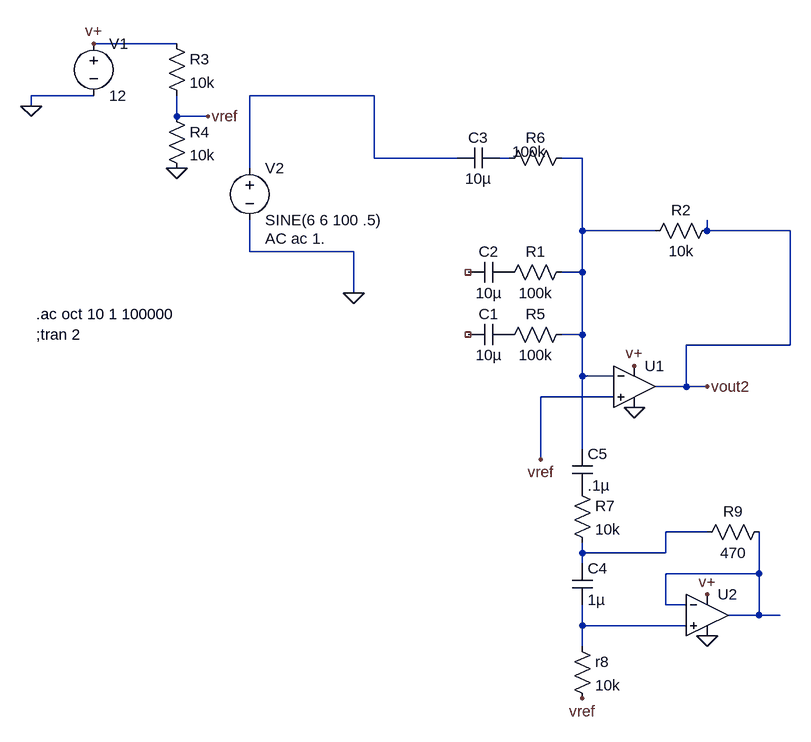
[diagram p0: schematic mixer.asc]
mixer.asc, the LTspice schematic file:
Version 4
SHEET 1 3432 680
WIRE 2416 -640 2288 -640
WIRE 2288 -560 2192 -560
WIRE 2720 -560 2528 -560
WIRE 2192 -544 2192 -560
WIRE 2416 -528 2416 -560
WIRE 2464 -528 2416 -528
WIRE 2720 -464 2720 -560
WIRE 2848 -464 2720 -464
WIRE 2928 -464 2912 -464
WIRE 3040 -464 3008 -464
WIRE 2528 -448 2528 -560
WIRE 3040 -352 3040 -464
WIRE 3152 -352 3040 -352
WIRE 3232 -352 3232 -368
WIRE 3360 -352 3232 -352
WIRE 2528 -320 2528 -368
WIRE 2688 -320 2528 -320
WIRE 3040 -288 3040 -352
WIRE 3040 -288 3008 -288
WIRE 2688 -256 2688 -320
WIRE 3040 -192 3040 -288
WIRE 3040 -192 3008 -192
WIRE 3360 -176 3360 -352
WIRE 3360 -176 3200 -176
WIRE 3040 -128 3040 -192
WIRE 3088 -128 3040 -128
WIRE 3200 -112 3200 -176
WIRE 3200 -112 3152 -112
WIRE 3232 -112 3200 -112
WIRE 3088 -96 2976 -96
WIRE 3040 -16 3040 -128
WIRE 2976 0 2976 -96
WIRE 3232 112 3168 112
WIRE 3040 144 3040 128
WIRE 3168 144 3168 112
WIRE 3168 144 3040 144
WIRE 3040 160 3040 144
WIRE 3312 176 3312 112
WIRE 3312 176 3168 176
WIRE 3168 224 3168 176
WIRE 3200 224 3168 224
WIRE 3312 240 3312 176
WIRE 3312 240 3264 240
WIRE 3344 240 3312 240
WIRE 3040 256 3040 224
WIRE 3200 256 3040 256
WIRE 3040 288 3040 256
FLAG 2688 -256 0
FLAG 2192 -544 0
FLAG 2288 -640 v+
FLAG 3120 -144 v+
FLAG 3232 -112 vout2
FLAG 2464 -528 vref
FLAG 2416 -448 0
FLAG 2976 0 vref
FLAG 3120 -80 0
FLAG 3232 208 v+
FLAG 3232 272 0
FLAG 3040 368 vref
SYMBOL voltage 2288 -656 R0
WINDOW 123 0 0 Left 2
WINDOW 39 0 0 Left 2
SYMATTR InstName V1
SYMATTR Value 12
SYMBOL voltage 2528 -464 R0
WINDOW 123 24 124 Left 2
WINDOW 39 0 0 Left 2
SYMATTR Value2 AC ac 1.
SYMATTR InstName V2
SYMATTR Value SINE(6 6 100 .5)
SYMBOL Opamps\\UniversalOpamp2 3120 -112 R0
SYMATTR InstName U1
SYMBOL res 3248 -368 R90
WINDOW 0 0 56 VBottom 2
WINDOW 3 32 56 VTop 2
SYMATTR InstName R2
SYMATTR Value 10k
SYMBOL cap 2912 -480 R90
WINDOW 0 0 32 VBottom 2
WINDOW 3 32 32 VTop 2
SYMATTR InstName C3
SYMATTR Value 10µ
SYMBOL res 2400 -656 R0
SYMATTR InstName R3
SYMATTR Value 10k
SYMBOL res 2400 -544 R0
SYMATTR InstName R4
SYMATTR Value 10k
SYMBOL cap 2928 -208 R90
WINDOW 0 0 32 VBottom 2
WINDOW 3 32 32 VTop 2
SYMATTR InstName C1
SYMATTR Value 10µ
SYMBOL cap 2928 -304 R90
WINDOW 0 0 32 VBottom 2
WINDOW 3 32 32 VTop 2
SYMATTR InstName C2
SYMATTR Value 10µ
SYMBOL res 3024 -304 R90
WINDOW 0 0 56 VBottom 2
WINDOW 3 32 56 VTop 2
SYMATTR InstName R1
SYMATTR Value 100k
SYMBOL res 3024 -208 R90
WINDOW 0 0 56 VBottom 2
WINDOW 3 32 56 VTop 2
SYMATTR InstName R5
SYMATTR Value 100k
SYMBOL res 3024 -480 R90
WINDOW 0 0 56 VBottom 2
WINDOW 3 -9 66 VTop 2
SYMATTR InstName R6
SYMATTR Value 100k
SYMBOL Opamps\\UniversalOpamp2 3232 240 R0
SYMATTR InstName U2
SYMBOL res 3024 32 R0
SYMATTR InstName R7
SYMATTR Value 10k
SYMBOL res 3024 272 R0
SYMATTR InstName r8
SYMATTR Value 10k
SYMBOL res 3328 96 R90
WINDOW 0 0 56 VBottom 2
WINDOW 3 32 56 VTop 2
SYMATTR InstName R9
SYMATTR Value 470
SYMBOL cap 3024 160 R0
SYMATTR InstName C4
SYMATTR Value 1µ
SYMBOL cap 3024 -16 R0
SYMATTR InstName C5
SYMATTR Value .1µ
TEXT 2200 -192 Left 2 !;tran 2
TEXT 2200 -224 Left 2 !.ac oct 10 1 100000

The netlist it stands for:
* mixer.asc
V1 v+ 0 12
V2 N001 0 SINE(6 6 100 .5) AC ac 1.
XU1 vref N003 v+ 0 vout2 level.2 Avol=1Meg GBW=10Meg Slew=10Meg ilimit=25m rail=0 Vos=0 phimargin=45 en=0 enk=0 in=0 ink=0 Rin=500Meg  ; pins IN+ IN- V+ V- OUT
R2 vout2 N003 10k
C3 N002 N001 10µ
R3 v+ vref 10k
R4 vref 0 10k
C1 P001 NC_01 10µ
C2 P002 NC_02 10µ
R1 N003 P002 100k
R5 N003 P001 100k
R6 N003 N002 100k
XU2 N006 N005 v+ 0 N005 level.2 Avol=1Meg GBW=10Meg Slew=10Meg ilimit=25m rail=0 Vos=0 phimargin=45 en=0 enk=0 in=0 ink=0 Rin=500Meg  ; pins IN+ IN- V+ V- OUT
R7 P003 N004 10k
r8 N006 vref 10k
R9 N005 N004 470
C4 N004 N006 1µ
C5 N003 P003 .1µ
;tran 2
.ac oct 10 1 100000
.lib UniversalOpamps2.sub
.backanno
.end